# EAGLE design LEDPulserBoard_Split_3 (EAGLE 7.6.0)
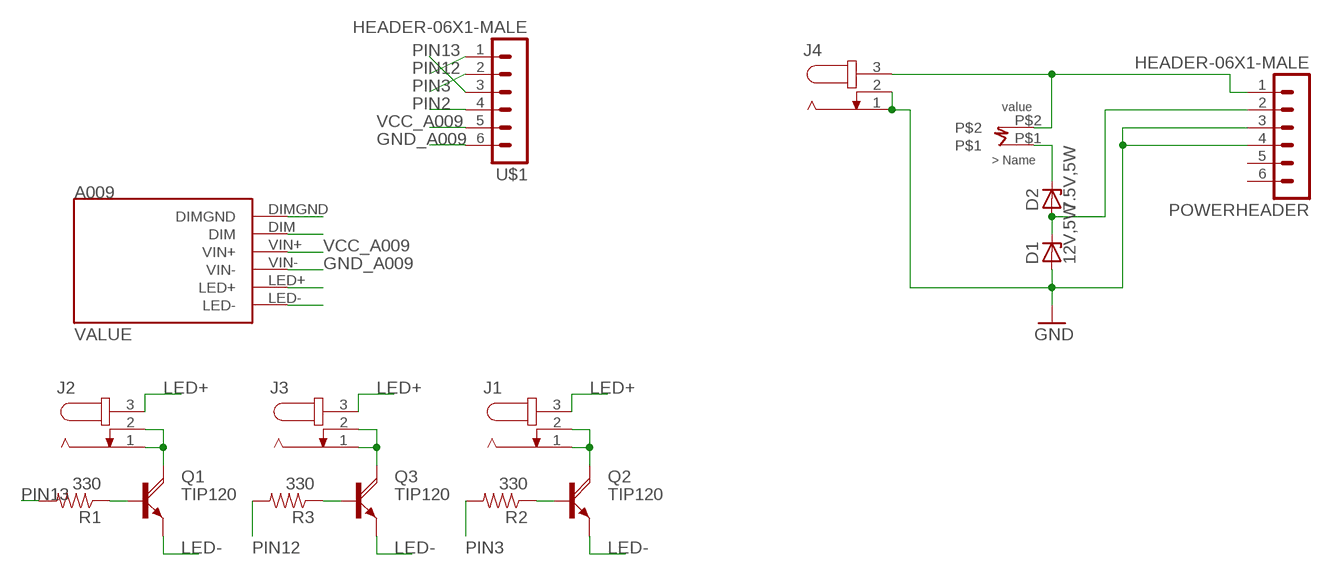
[diagram p0: schematic, sheet 1]

## Parts
D1  12V,5W  1N5333  [C1702-15]
D2  7.5V,5W  1N5333  [C1702-15]
J1  JACK-PLUG0  [SPC4077]
J2  JACK-PLUG0  [SPC4077]
J3  JACK-PLUG0  [SPC4077]
J4  JACK-PLUG0  [SPC4077]
POWERHEADER  HEADER-06X1-MALE  [06X1-PTH]
Q1  TIP120  [TO220AH]
Q2  TIP120  [TO220AH]
Q3  TIP120  [TO220AH]
R1  330  RESISTORPTH-1/4W  [AXIAL-0.4]
R2  330  RESISTORPTH-1/4W  [AXIAL-0.4]
R3  330  RESISTORPTH-1/4W  [AXIAL-0.4]
U$1  HEADER-06X1-MALE  [06X1-PTH]
U$2  BUCKBLOCKA009  [BUCKBLOCK]
U$3  5WRES  [5WAXIAL]

## Nets
ARDUINOIN [PWD]: D1.C D2.A POWERHEADER.2
DIM: U$2.DIM
DIMGND: U$2.DIMGND
GND [PWD]: D1.A J4.1 J4.2 POWERHEADER.3 POWERHEADER.4
GND_A009: U$1.6 U$2.VIN-
LED+: J1.3 J2.3 J3.3 U$2.LED+
LED-: Q1.E Q2.E Q3.E U$2.LED-
N$1: J1.1 J1.2 Q2.C
N$2: Q2.B R2.P$1
N$3: J2.1 J2.2 Q1.C
N$4: Q1.B R1.P$1
N$5: J3.1 J3.2 Q3.C
N$6: Q3.B R3.P$1
N$13 [PWD]: D2.C U$3.P$1
PIN2: U$1.4
PIN3: R2.P$2 U$1.2
PIN12: R3.P$2 U$1.1
PIN13: R1.P$2 U$1.3
VCC [PWD]: J4.3 POWERHEADER.1 U$3.P$2
VCC_A009: U$1.5 U$2.VIN+
Unconnected: POWERHEADER.5 POWERHEADER.6

## Library data of the parts
D1 D2 = diode:1N5333: Z DIODE 3.3 V, 5W, 5 percent (Motorola)
J1-J4 = con-jack:JACK-PLUG: DC POWER JACK Power Jack, DC, Right Angle, Through Hole, Rated 5A at 16VDC, PC Terminals Distributor: Farnell (www.Farnell.de) Drawing: 84N1161.pdf / 84N1162.pdf Manufacturer: SPC Technology (www.spctechnology.com) Type: SPC4077 / SPC 4078; OC_FARNELL: unknown; OC_NEWARK: unknown
POWERHEADER U$1 = GeekAmmo:HEADER-06X1?: 6 x 0.1 inch Header 40x1 0.1inch Male Breakaway header can be used. - 4UCON 00834 <http://www.4uconnector.com/online/SearchPro.asp?FormName=ProSearch&FormAction=search&s_GroupNo=&s_keyword=00834> For female part, if possible use 6 x 1 without breaking.; OTHER: 4UCON 00834; URL: http://www.4uconnector.com/online/SearchPro.asp?FormName=ProSearch&FormAction=search&s_GroupNo=&s_keyword=00834
Q1-Q3 = transistor-power:TIP120: NPN DARLINGTON TRANSISTOR
R1-R3 = SparkFun-Passives:RESISTOR: Resistor Basic schematic elements and footprints for 0603, 1206, and PTH resistors.
U$2 = A009Buckblock:BUCKBLOCKA009: 2100mA BuckBlock Constant Current Driver A009-D-V-2100 Vin (10-32V) DIM (0-10V)
U$3 = 5wAxial:5WRES

## Net classes
0 default: width 0.508 mm, drill 0.813 mm, clearance 0.813 mm
1 PWD: width 1.016 mm, drill 0.813 mm, clearance 1.016 mm

## Board
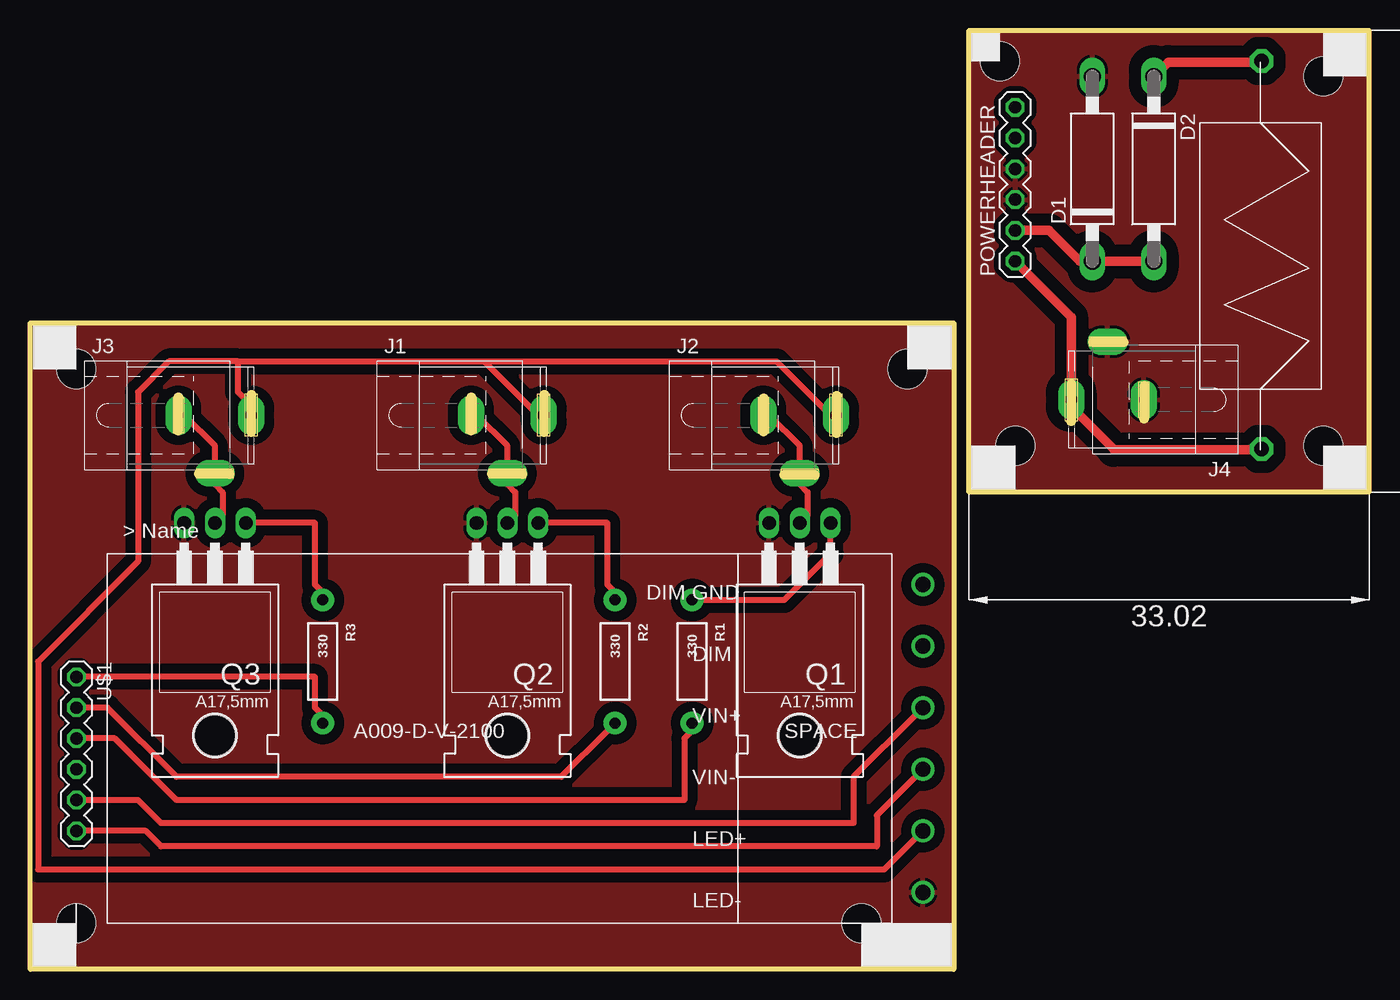
[diagram p1: board, top side]

Size 110.49 x 77.47 mm. Coordinates in mm from the lower left corner, seen from the top.
Outline: 12.24,47.19 12.22,47.19 12.22,44.45
Outline: 18.26,47.4 18.24,47.4 18.24,44.3
Outline: 13.89,40.87 16.46,40.87 16.46,40.84
Outline: 36.4,47.19 36.37,47.19 36.37,44.45
Outline: 42.42,47.4 42.39,47.4 42.39,44.3
Outline: 38.05,40.87 40.62,40.87 40.62,40.84
Outline: 60.53,47.12 60.5,47.12 60.5,44.37
Outline: 66.55,47.32 66.52,47.32 66.52,44.22
Outline: 62.18,40.79 64.75,40.79 64.75,40.77
Outline: 91.9,45.41 91.92,45.41 91.92,48.16
Outline: 85.88,45.21 85.9,45.21 85.9,48.31
Outline: 90.25,51.74 87.68,51.74 87.68,51.77
Outline: 0,0 0,53.34 76.2,53.34 76.2,0 0,0
Outline: 110.49,39.37 110.49,77.47 77.47,77.47 77.47,39.37 110.49,39.37
Copper layers (1*16): Top 0.035mm / dielectric 1.5mm / Bottom 0.035mm
Design rules "OthermillDRC_1_64_v2": minimum track width 16mil, minimum drill 31mil, track to track 0.39878125mm, track to pad 0.39878125mm, pad to pad 0.39878125mm, via to via 0.39878125mm, smd to smd 0mil, copper to edge 0mil, drill to drill 1mil, minimum pad ring 0mil, minimum via ring 15mil, stop-mask expansion 1mil, vias tented up to drill 30mil, thermal gap 10mil
Holes 3.2 mm at 3.81,3.81 3.81,49.53 72.39,49.53 68.58,3.81 106.68,43.18 106.68,73.66 81.28,43.18 80.01,74.93

### Footprints (pad centres in the part's own frame; a part is rotated, then mirrored left to right if it is on the bottom)
C1702-15 = drill 1.397 long: A 7.62,0; C -7.62,0
SPC4077 = drill 0.8 pad 2.184 long: 1 -3,0; 2 0,-4.8 | drill 1 pad 2.184 long: 3 3,0
06X1-PTH = drill 1.016 octagon: 1 -6.35,0; 2 -3.81,0; 3 -1.27,0; 4 1.27,0; 5 3.81,0; 6 6.35,0
TO220AH = drill 1.118 long: B -2.54,-6.35; C 0,-6.35; E 2.54,-6.35 | hole 3.302: 0,11.176
AXIAL-0.4 = drill 0.9 pad 1.88: P$1 -5.08,0; P$2 5.08,0
BUCKBLOCK = drill 1.27: DIM 67.31,22.86; DIMGND 67.31,27.94; LED+ 67.31,7.62; LED- 67.31,2.54; VIN+ 67.31,17.78; VIN- 67.31,12.7
5WAXIAL = drill 0.8: P$1 -5,5; P$2 27,5

### Placement (x,y rotation side)
D1  87.63,66.04 90 top
D2  92.71,66.04 270 top
J1  39.37,45.72 0 top
J2  63.5,45.72 0 top
J3  15.24,45.72 0 top
J4  88.9,46.99 180 top
POWERHEADER  81.28,64.77 90 top
Q1  63.5,30.48 180 top
Q2  39.37,30.48 180 top
Q3  15.24,30.48 180 top
R1  54.61,25.4 270 top
R2  48.26,25.4 270 top
R3  24.13,25.4 270 top
U$1  3.81,17.78 270 top
U$2  6.35,3.81 0 top
U$3  96.52,69.85 270 top

### Tracks (layer width: path | path; a pad name or v marks a point on that pad's centre or on a via)
ARDUINOIN
  Top 0.787: POWERHEADER.2 84.07,60.96 86.61,58.42 D1.C D2.A
GND
  pour Top: 77.47,77.47 110.49,77.47 110.49,39.37 77.47,39.37
GND_A009
  Top 0.508: U$1.6 9.53,11.43 10.79,10.16 69.85,10.16 69.85,12.7 73.03,15.88 73.66,15.88 U$2.VIN-
LED+
  Top 0.508: U$2.LED+ 70.48,8.26 0.64,8.26 0.64,25.4 8.89,33.66 8.89,47.62 11.43,50.16 17.14,50.16 | 17.14,50.16 17.14,47.62 17.78,46.99 17.78,45.72 J3.3 | 37.47,50.16 41.91,45.72 J1.3 | 17.14,50.16 37.47,50.16 | 37.47,50.16 61.59,50.16 66.04,45.72 J2.3
LED-
  pour Top: 0,53.34 76.2,53.34 76.2,0 0,0
N$1
  Top 0.508: Q2.C 40.01,37.47 40.01,39.37 39.37,40.01 J1.2 39.37,43.18 36.83,45.72 J1.1
N$2
  Top 0.508: Q2.B 47.62,36.83 47.62,31.75 48.26,31.11 R2.P$1
N$3
  Top 0.508: Q1.C 64.14,37.47 64.14,39.37 63.5,40.01 J2.2 63.5,43.18 60.96,45.72 J2.1
N$4
  Top 0.508: Q1.B 66.04,34.29 62.23,30.48 R1.P$1
N$5
  Top 0.508: Q3.C 15.88,37.47 15.88,39.37 15.24,40.01 J3.2 15.24,43.18 12.7,45.72 J3.1
N$6
  Top 0.508: Q3.B 23.5,36.83 23.5,31.75 24.13,31.11 R3.P$1
N$7  (via drill 1.2 pad 1.68)
  other vias: 101.6,42.93
N$8  (via drill 1.2 pad 1.68)
  other vias: 101.6,74.93
N$13
  Top 0.787: D2.C 93.9,74.85 U$3.P$1
PIN3
  Top 0.508: U$1.2 6.35,21.59 12.06,15.88 43.81,15.88 47.62,19.68 48.26,19.68 R2.P$2
PIN12
  Top 0.508: U$1.1 23.5,24.13 23.5,21.59 24.13,20.95 R3.P$2
PIN13
  Top 0.508: U$1.3 6.99,19.05 12.06,13.97 53.98,13.97 53.98,19.05 54.61,19.68 R1.P$2
VCC
  Top 0.787: U$3.P$2 89.41,42.85 89.41,42.93 85.9,46.43 J4.3 85.9,53.8 POWERHEADER.1
VCC_A009
  Top 0.508: U$1.5 8.89,13.97 10.79,12.06 67.94,12.06 67.94,15.88 73.03,20.95 73.66,20.95 U$2.VIN+